# Altium project LF_SFF_AC.PrjPCB
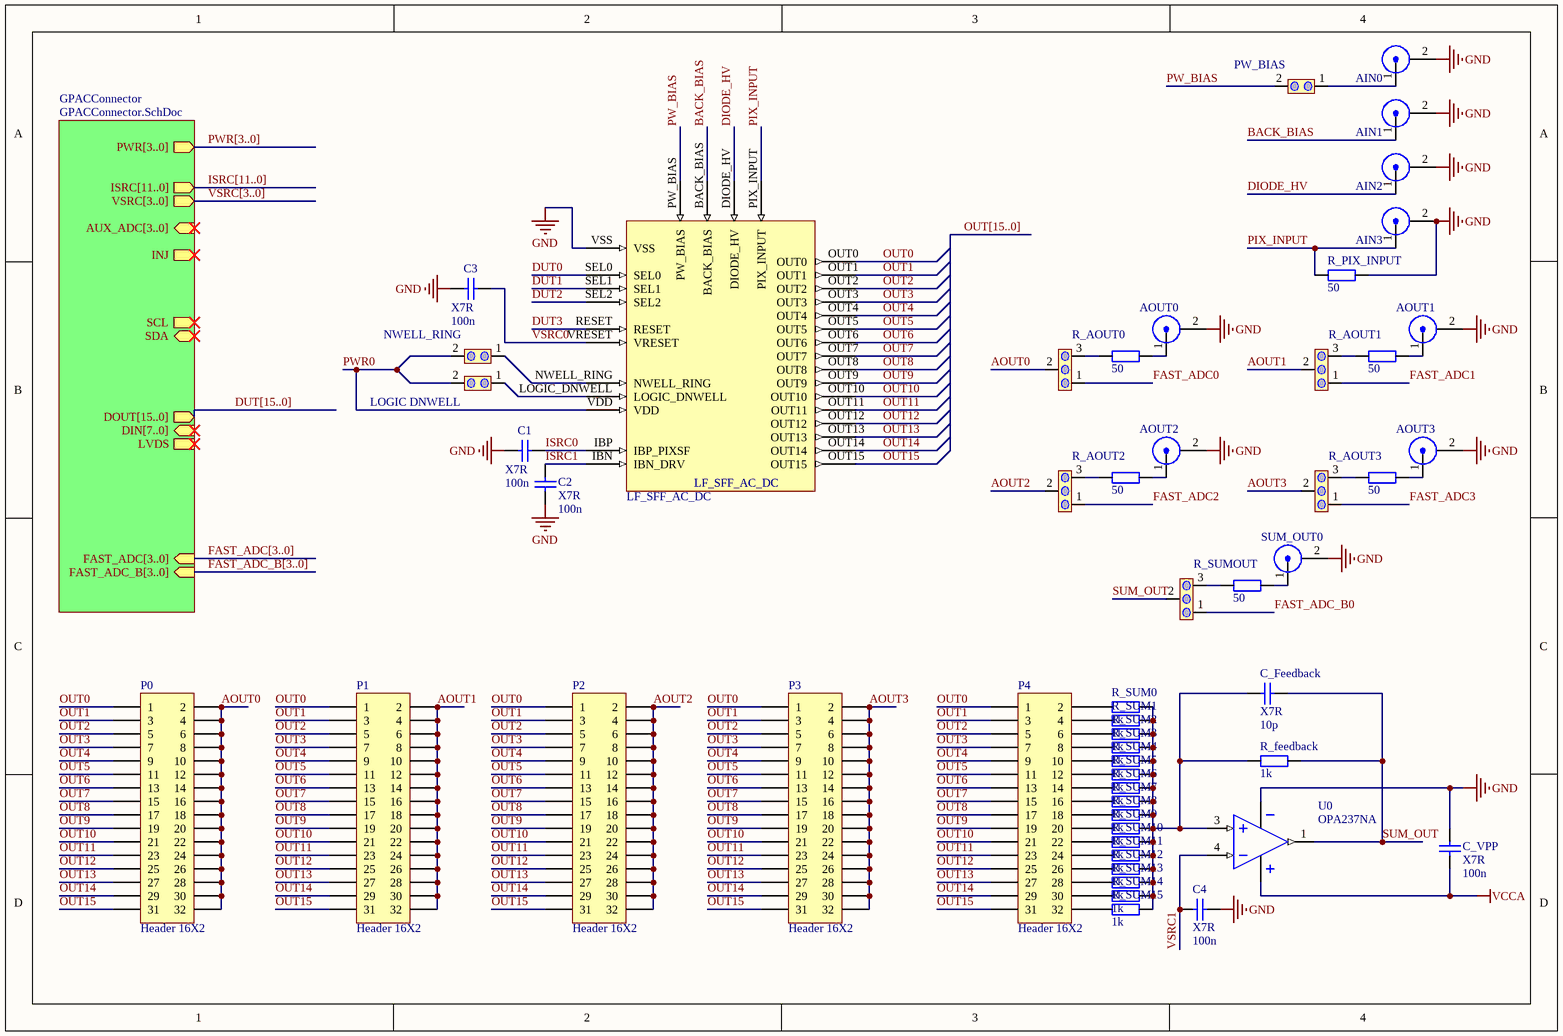
[diagram p0: LF_SDD_AC_DC.SchDoc]
2 sheets, 54 parts. Net scope: hierarchical (ports join the sheet entries above them; power ports are global).
Board file: LF_SFF_AC_DC.PcbDoc
Sheets:
  LF_SDD_AC_DC.SchDoc
    GPACConnector = GPACConnector.SchDoc

## Sheet LF_SDD_AC_DC.SchDoc
size A4; Author: Dominic Schüchter

### Parts
AIN0  -  [LEMO horiz.]  (value not drawn)
AIN1  -  [LEMO horiz.]  (value not drawn)
AIN2  -  [LEMO horiz.]  (value not drawn)
AIN3  -  [LEMO horiz.]  (value not drawn)
AOUT0  -  [LEMO horiz.]  (value not drawn)
AOUT1  -  [LEMO horiz.]  (value not drawn)
AOUT2  -  [LEMO horiz.]  (value not drawn)
AOUT3  -  [LEMO horiz.]  (value not drawn)
AOUT_SEL0  -  [HDR 1x3]  (value not drawn)
AOUT_SEL1  -  [HDR 1x3]  (value not drawn)
AOUT_SEL2  -  [HDR 1x3]  (value not drawn)
AOUT_SEL3  -  [HDR 1x3]  (value not drawn)
C1  X7R  value 100n  [C0603_imp_N]
C2  X7R  value 100n  [C0603_imp_N]
C3  X7R  value 100n  [C0603_imp_N]
C4  X7R  value 100n  [C0603_imp_N]
C_Feedback  X7R  value 10p  [C0603_imp_N]
C_VPP  X7R  value 100n  [C0603_imp_N]
LF_SFF_AC_DC  LF_SFF_AC_DC  [LF_SFF_COMBI]
LOGIC_DNWELL  -  [CON 1x2 std]  (value not drawn)
NWELL_RING  -  [CON 1x2 std]  (value not drawn)
P0  Header 16X2  [HDR2X16]
P1  Header 16X2  [HDR2X16]
P2  Header 16X2  [HDR2X16]
P3  Header 16X2  [HDR2X16]
P4  Header 16X2  [HDR2X16]
PW_BIAS  -  [CON 1x2 std]  (value not drawn)
R_AOUT0  value 50  [R0603_imp_N]  (hidden comment: R)
R_AOUT1  value 50  [R0603_imp_N]  (hidden comment: R)
R_AOUT2  value 50  [R0603_imp_N]  (hidden comment: R)
R_AOUT3  value 50  [R0603_imp_N]  (hidden comment: R)
R_feedback  value 1k  [R0805_imp_M]  (hidden comment: R)
R_PIX_INPUT  value 50  [R0603_imp_N]  (hidden comment: R)
R_SUM0  value 1k  [R0805_imp_M]  (hidden comment: R)
R_SUM1  value 1k  [R0805_imp_M]  (hidden comment: R)
R_SUM2  value 1k  [R0805_imp_M]  (hidden comment: R)
R_SUM3  value 1k  [R0805_imp_M]  (hidden comment: R)
R_SUM4  value 1k  [R0805_imp_M]  (hidden comment: R)
R_SUM5  value 1k  [R0805_imp_M]  (hidden comment: R)
R_SUM6  value 1k  [R0805_imp_M]  (hidden comment: R)
R_SUM7  value 1k  [R0805_imp_M]  (hidden comment: R)
R_SUM8  value 1k  [R0805_imp_M]  (hidden comment: R)
R_SUM9  value 1k  [R0805_imp_M]  (hidden comment: R)
R_SUM10  value 1k  [R0805_imp_M]  (hidden comment: R)
R_SUM11  value 1k  [R0805_imp_M]  (hidden comment: R)
R_SUM12  value 1k  [R0805_imp_M]  (hidden comment: R)
R_SUM13  value 1k  [R0805_imp_M]  (hidden comment: R)
R_SUM14  value 1k  [R0805_imp_M]  (hidden comment: R)
R_SUM15  value 1k  [R0805_imp_M]  (hidden comment: R)
R_SUMOUT  value 50  [R0603_imp_N]  (hidden comment: R)
SUM_OUT0  -  [LEMO horiz.]  (value not drawn)
SUM_SELECT  -  [HDR 1x3]  (value not drawn)
U0  Type_1: OPA237NA  [SOT23-5]  (hidden comment: OPA237)

### Sub-sheets
GPACConnector = GPACConnector.SchDoc: PWR[3..0] (out), ISRC[11..0] (out), VSRC[3..0] (out), AUX_ADC[3..0] (in), DOUT[15..0] (out), DIN[7..0] (in), FAST_ADC[3..0] (in), FAST_ADC_B[3..0] (in), LVDS (harness LVDS), INJ (out), SDA (bidir), SCL (out)

### Nets
GND: AIN0.2 AIN1.2 AIN2.2 AIN3.2 AOUT0.2 AOUT1.2 AOUT2.2 AOUT3.2 C1.2 C2.2 C3.2 C4.2 C_VPP.1 LF_SFF_AC_DC.VSS R_PIX_INPUT.2 SUM_OUT0.2 U0.2(V-)
VCCA: C_VPP.2 U0.5(V+)
AOUT0: AOUT_SEL0.2 P0.2 P0.4 P0.6 P0.8 P0.10 P0.12 P0.14 P0.16 P0.18 P0.20 P0.22 P0.24 P0.26 P0.28 P0.30 P0.32
AOUT1: AOUT_SEL1.2 P1.2 P1.4 P1.6 P1.8 P1.10 P1.12 P1.14 P1.16 P1.18 P1.20 P1.22 P1.24 P1.26 P1.28 P1.30 P1.32
AOUT2: AOUT_SEL2.2 P2.2 P2.4 P2.6 P2.8 P2.10 P2.12 P2.14 P2.16 P2.18 P2.20 P2.22 P2.24 P2.26 P2.28 P2.30 P2.32
AOUT3: AOUT_SEL3.2 P3.2 P3.4 P3.6 P3.8 P3.10 P3.12 P3.14 P3.16 P3.18 P3.20 P3.22 P3.24 P3.26 P3.28 P3.30 P3.32
BACK_BIAS: AIN1.1 LF_SFF_AC_DC.BACK_BIAS
DIODE_HV: AIN2.1 LF_SFF_AC_DC.DIODE_HV
DUT0: LF_SFF_AC_DC.SEL0  [project net DOUT0]
DUT1: LF_SFF_AC_DC.SEL1  [project net DOUT1]
DUT2: LF_SFF_AC_DC.SEL2  [project net DOUT2]
DUT3: LF_SFF_AC_DC.RESET  [project net DOUT3]
FAST_ADC0: AOUT_SEL0.1
FAST_ADC1: AOUT_SEL1.1
FAST_ADC2: AOUT_SEL2.1
FAST_ADC3: AOUT_SEL3.1
FAST_ADC_B0: SUM_SELECT.1
ISRC0: C1.1 LF_SFF_AC_DC.IBP(IBP_PIXSF)
ISRC1: C2.1 LF_SFF_AC_DC.IBN(IBN_DRV)
OUT0: LF_SFF_AC_DC.OUT0 P0.1 P1.1 P2.1 P3.1 P4.1
OUT1: LF_SFF_AC_DC.OUT1 P0.3 P1.3 P2.3 P3.3 P4.3
OUT2: LF_SFF_AC_DC.OUT2 P0.5 P1.5 P2.5 P3.5 P4.5
OUT3: LF_SFF_AC_DC.OUT3 P0.7 P1.7 P2.7 P3.7 P4.7
OUT4: LF_SFF_AC_DC.OUT4 P0.9 P1.9 P2.9 P3.9 P4.9
OUT5: LF_SFF_AC_DC.OUT5 P0.11 P1.11 P2.11 P3.11 P4.11
OUT6: LF_SFF_AC_DC.OUT6 P0.13 P1.13 P2.13 P3.13 P4.13
OUT7: LF_SFF_AC_DC.OUT7 P0.15 P1.15 P2.15 P3.15 P4.15
OUT8: LF_SFF_AC_DC.OUT8 P0.17 P1.17 P2.17 P3.17 P4.17
OUT9: LF_SFF_AC_DC.OUT9 P0.19 P1.19 P2.19 P3.19 P4.19
OUT10: LF_SFF_AC_DC.OUT10 P0.21 P1.21 P2.21 P3.21 P4.21
OUT11: LF_SFF_AC_DC.OUT11 P0.23 P1.23 P2.23 P3.23 P4.23
OUT12: LF_SFF_AC_DC.OUT12 P0.25 P1.25 P2.25 P3.25 P4.25
OUT13: LF_SFF_AC_DC.OUT13 P0.27 P1.27 P2.27 P3.27 P4.27
OUT14: LF_SFF_AC_DC.OUT14 P0.29 P1.29 P2.29 P3.29 P4.29
OUT15: LF_SFF_AC_DC.OUT15 P0.31 P1.31 P2.31 P3.31 P4.31
PIX_INPUT: AIN3.1 LF_SFF_AC_DC.PIX_INPUT R_PIX_INPUT.1
PW_BIAS: LF_SFF_AC_DC.PW_BIAS PW_BIAS.2
PWR0: LF_SFF_AC_DC.VDD LOGIC_DNWELL.2 NWELL_RING.2
SUM_OUT: C_Feedback.2 R_feedback.2 SUM_SELECT.2 U0.1(OUT)
VSRC0: C3.1 LF_SFF_AC_DC.VRESET
VSRC1: C4.1 U0.4(IN-)
NetAIN0_1: AIN0.1 PW_BIAS.1
NetAOUT0_1: AOUT0.1 R_AOUT0.1
NetAOUT1_1: AOUT1.1 R_AOUT1.1
NetAOUT2_1: AOUT2.1 R_AOUT2.1
NetAOUT3_1: AOUT3.1 R_AOUT3.1
NetAOUT_SEL0_3: AOUT_SEL0.3 R_AOUT0.2
NetAOUT_SEL1_3: AOUT_SEL1.3 R_AOUT1.2
NetAOUT_SEL2_3: AOUT_SEL2.3 R_AOUT2.2
NetAOUT_SEL3_3: AOUT_SEL3.3 R_AOUT3.2
NetC_Feedback_1: C_Feedback.1 R_feedback.1 R_SUM0.2 R_SUM1.2 R_SUM2.2 R_SUM3.2 R_SUM4.2 R_SUM5.2 R_SUM6.2 R_SUM7.2 R_SUM8.2 R_SUM9.2 R_SUM10.2 R_SUM11.2 R_SUM12.2 R_SUM13.2 R_SUM14.2 R_SUM15.2 U0.3(IN+)
NetLF_SFF_AC_DC_LOGIC_DNWELL: LF_SFF_AC_DC.LOGIC_DNWELL LOGIC_DNWELL.1
NetLF_SFF_AC_DC_NWELL_RING: LF_SFF_AC_DC.NWELL_RING NWELL_RING.1
NetP4_2: P4.2 R_SUM0.1
NetP4_4: P4.4 R_SUM1.1
NetP4_6: P4.6 R_SUM2.1
NetP4_8: P4.8 R_SUM3.1
NetP4_10: P4.10 R_SUM4.1
NetP4_12: P4.12 R_SUM5.1
NetP4_14: P4.14 R_SUM6.1
NetP4_16: P4.16 R_SUM7.1
NetP4_18: P4.18 R_SUM8.1
NetP4_20: P4.20 R_SUM9.1
NetP4_22: P4.22 R_SUM10.1
NetP4_24: P4.24 R_SUM11.1
NetP4_26: P4.26 R_SUM12.1
NetP4_28: P4.28 R_SUM13.1
NetP4_30: P4.30 R_SUM14.1
NetP4_32: P4.32 R_SUM15.1
NetR_SUMOUT_1: R_SUMOUT.1 SUM_OUT0.1
NetR_SUMOUT_2: R_SUMOUT.2 SUM_SELECT.3

### Buses and harness runs
bus DUT[15..0] = sheet GPACConnector/DOUT[15..0]
bus FAST_ADC[3..0] = sheet GPACConnector/FAST_ADC[3..0]
bus FAST_ADC_B[3..0] = sheet GPACConnector/FAST_ADC_B[3..0]
bus ISRC[11..0] = sheet GPACConnector/ISRC[11..0]
bus OUT[15..0]
bus PWR[3..0] = sheet GPACConnector/PWR[3..0]
bus VSRC[3..0] = sheet GPACConnector/VSRC[3..0]

### Library data of the parts
AIN0-AIN3 AOUT0-AOUT3 SUM_OUT0 = LEMO coax: LEMO/BNC Buchse, aufrecht od. gewinkelt; Class: Connector; Comment_1: LEMO; Type_1: EPL.00.250.NTN; Constraints: -; HelpURL: -; LatestRevisionDate: 24-Sep-2008; Publisher: Silab C.H.; Value: -; PackageDescription: -
AOUT_SEL0-AOUT_SEL3 SUM_SELECT = JUMPER 1X3S: Jumper, Solderbridge 1x3; Class: Connector; Comment_1: -; Constraints: -; HelpURL: -; LatestRevisionDate: 24-Sep-2008; Publisher: Silab C.H.; Type_1: -; Value: -; PackageDescription: -
C1-C4 C_Feedback C_VPP = C: Capacitor; Constraints: 6.3V; Class: Passive; Type_1: SMD Chip Capacitor; Comment_1: -; LatestRevisionDate: 27-Nov-2007; Publisher: Silab J.S.; HelpURL: -; PackageDescription: -
LF_SFF_AC_DC = LF_SFF_AC
LOGIC_DNWELL NWELL_RING PW_BIAS = JUMPER 1X2S: Jumper, Solderbridge 1x2; Class: Connector; Comment_1: -; Constraints: -; HelpURL: -; LatestRevisionDate: 24-Sep-2008; Publisher: Silab C.H.; Type_1: -; Value: -; PackageDescription: -
P0-P4 = Header 16X2: Header, 16-Pin, Dual row; LatestRevisionDate: 17-Jul-2002; LatestRevisionNote: Re-released for DXP Platform.; Publisher: Altium Limited
R_AOUT0-R_AOUT3 R_feedback R_PIX_INPUT R_SUM0-R_SUM15 R_SUMOUT = R: SMD Chip Resistor; Constraints: 1%; Class: Passive; Comment_1: -; Publisher: Silab J.S.; LatestRevisionDate: 27-Nov-2007; HelpURL: -; Type_1: SMD Chip Resistor; PackageDescription: -
U0 = OPA237: OpAmp (TI), single supply up to +36V;; Class: Active; Comment_1: Texas Instruments; Netto_price: 1,58; Order_number: 1207102; Constraints: -; HelpURL: http://focus.ti.com/lit/ds/symlink/opa237.pdf; LatestRevisionDate: 26-Aug-2009; Publisher: Silab J.S.; Value: -; PackageDescription: -; Distributor: Farnell

## Sheet GPACConnector.SchDoc: GPAC Connector
size A4; Author: H.Krüger; DrawnBy: H.Krüger; Organization: SILAB; Address1: Physikalisches Institut; Address2: Universität Bonn; Address3: Nußallee 12; Address4: 53115 Bonn; Revision: 1.1; SheetNumber: 2; SheetTotal: 2; Project: XTB01 Carrier
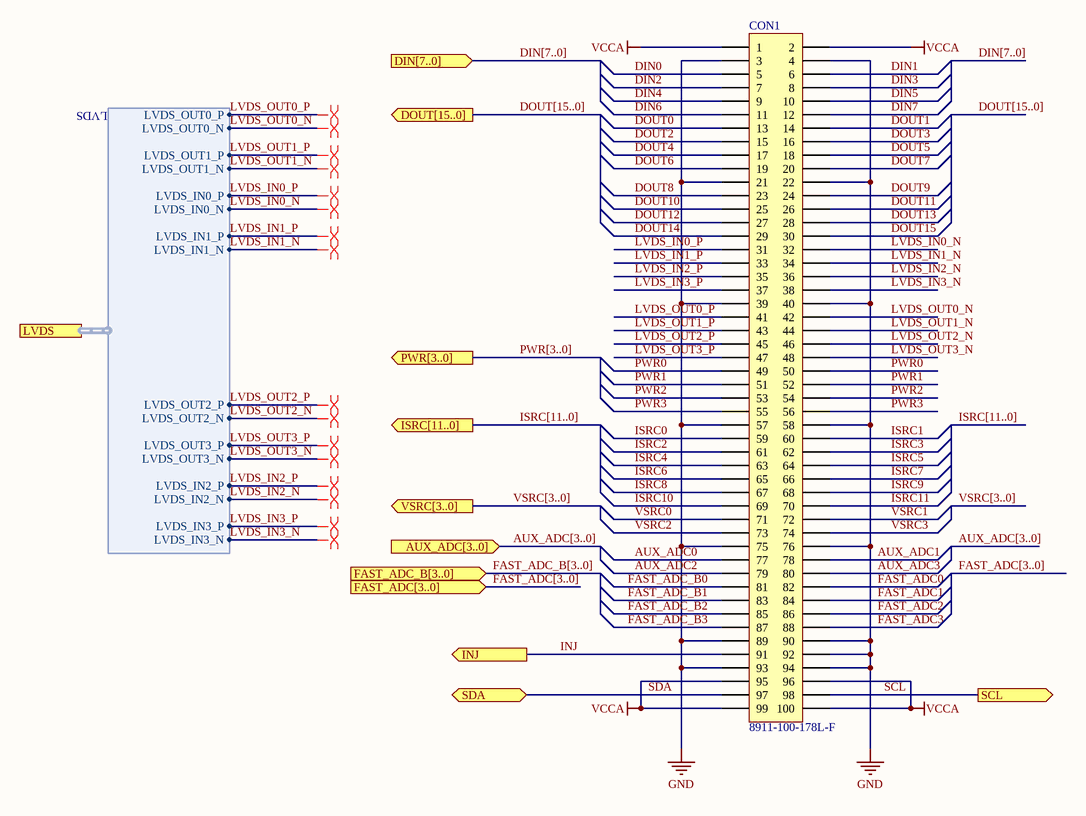
[diagram p1: GPACConnector.SchDoc]

### Parts
CON1  Type_1: 8911-100-178L-F  [KEL 8911-100-178L-F, PLUG]  (hidden comment: -)

### Ports
AUX_ADC[3..0] (in), DIN[7..0] (in), DOUT[15..0] (out), FAST_ADC[3..0] (in), FAST_ADC_B[3..0] (in), INJ (out), ISRC[11..0] (out), LVDS (harness LVDS), PWR[3..0] (out), SCL (out), SDA (bidir), VSRC[3..0] (out)

### Harnesses
LVDS: LVDS_IN0_P, LVDS_IN0_N, LVDS_IN1_P, LVDS_IN1_N, LVDS_OUT0_P, LVDS_OUT0_N, LVDS_OUT1_P, LVDS_OUT1_N, LVDS_IN2_P, LVDS_IN2_N, LVDS_IN3_P, LVDS_IN3_N, LVDS_OUT2_P, LVDS_OUT2_N, LVDS_OUT3_P, LVDS_OUT3_N

### Nets
GND: CON1.3 CON1.4 CON1.21 CON1.22 CON1.39 CON1.40 CON1.57 CON1.58 CON1.75 CON1.76 CON1.89 CON1.90 CON1.92 CON1.93 CON1.94
VCCA: CON1.1 CON1.2 CON1.95 CON1.96 CON1.99 CON1.100
AUX_ADC0: CON1.77
AUX_ADC1: CON1.78
AUX_ADC2: CON1.79
AUX_ADC3: CON1.80
DIN0: CON1.5
DIN1: CON1.6
DIN2: CON1.7
DIN3: CON1.8
DIN4: CON1.9
DIN5: CON1.10
DIN6: CON1.11
DIN7: CON1.12
DOUT0: CON1.13
DOUT1: CON1.14
DOUT2: CON1.15
DOUT3: CON1.16
DOUT4: CON1.17
DOUT5: CON1.18
DOUT6: CON1.19
DOUT7: CON1.20
DOUT8: CON1.23
DOUT9: CON1.24
DOUT10: CON1.25
DOUT11: CON1.26
DOUT12: CON1.27
DOUT13: CON1.28
DOUT14: CON1.29
DOUT15: CON1.30
FAST_ADC0: CON1.82
FAST_ADC1: CON1.84
FAST_ADC2: CON1.86
FAST_ADC3: CON1.88
FAST_ADC_B0: CON1.81
FAST_ADC_B1: CON1.83
FAST_ADC_B2: CON1.85
FAST_ADC_B3: CON1.87
INJ: CON1.91 ; port INJ
ISRC0: CON1.59
ISRC1: CON1.60
ISRC2: CON1.61
ISRC3: CON1.62
ISRC4: CON1.63
ISRC5: CON1.64
ISRC6: CON1.65
ISRC7: CON1.66
ISRC8: CON1.67
ISRC9: CON1.68
ISRC10: CON1.69
ISRC11: CON1.70
LVDS_IN0_N: CON1.32 ; port LVDS.LVDS_IN0_N
LVDS_IN0_P: CON1.31 ; port LVDS.LVDS_IN0_P
LVDS_IN1_N: CON1.34 ; port LVDS.LVDS_IN1_N
LVDS_IN1_P: CON1.33 ; port LVDS.LVDS_IN1_P
LVDS_IN2_N: CON1.36 ; port LVDS.LVDS_IN2_N
LVDS_IN2_P: CON1.35 ; port LVDS.LVDS_IN2_P
LVDS_IN3_N: CON1.38 ; port LVDS.LVDS_IN3_N
LVDS_IN3_P: CON1.37 ; port LVDS.LVDS_IN3_P
LVDS_OUT0_N: CON1.42 ; port LVDS.LVDS_OUT0_N
LVDS_OUT0_P: CON1.41 ; port LVDS.LVDS_OUT0_P
LVDS_OUT1_N: CON1.44 ; port LVDS.LVDS_OUT1_N
LVDS_OUT1_P: CON1.43 ; port LVDS.LVDS_OUT1_P
LVDS_OUT2_N: CON1.46 ; port LVDS.LVDS_OUT2_N
LVDS_OUT2_P: CON1.45 ; port LVDS.LVDS_OUT2_P
LVDS_OUT3_N: CON1.48 ; port LVDS.LVDS_OUT3_N
LVDS_OUT3_P: CON1.47 ; port LVDS.LVDS_OUT3_P
PWR0: CON1.49 CON1.50
PWR1: CON1.51 CON1.52
PWR2: CON1.53 CON1.54
PWR3: CON1.55 CON1.56
SCL: CON1.98 ; port SCL
SDA: CON1.97 ; port SDA
VSRC0: CON1.71
VSRC1: CON1.72
VSRC2: CON1.73
VSRC3: CON1.74

### Buses and harness runs
bus AUX_ADC[3..0]
bus AUX_ADC[3..0] = port AUX_ADC[3..0]
bus DIN[7..0]
bus DIN[7..0] = port DIN[7..0]
bus DOUT[15..0]
bus DOUT[15..0] = port DOUT[15..0]
bus FAST_ADC[3..0]
bus FAST_ADC[3..0] = port FAST_ADC[3..0]
bus FAST_ADC_B[3..0] = port FAST_ADC_B[3..0]
bus ISRC[11..0]
bus ISRC[11..0] = port ISRC[11..0]
bus PWR[3..0] = port PWR[3..0]
bus VSRC[3..0]
bus VSRC[3..0] = port VSRC[3..0]

### Layout directives
differential pair: LVDS_IN0_N, LVDS_IN0_P, LVDS_IN1_N, LVDS_IN1_P, LVDS_IN2_N, LVDS_IN2_P, LVDS_IN3_N, LVDS_IN3_P, LVDS_OUT0_N, LVDS_OUT0_P, LVDS_OUT1_N, LVDS_OUT1_P, LVDS_OUT2_N, LVDS_OUT2_P, LVDS_OUT3_N, LVDS_OUT3_P

### Notes on the sheet
- Title:
- Drawn by:
- Physikalisches Institut
- Universität Bonn
- Project:
- Date:
- File:
- Time:
- Revision:
- Sheet
- of
- Nußallee 12
- 53115 Bonn

### Library data of the parts
CON1 = CON KEL 8911, male: KEL 8911 100 pin board to board connector; Revision: July-2002: Re-released for DXP Platform.; Publisher: Silab J.S.; Class: Connector; Value: -; Constraints: -; HelpURL: http://www.kel.jp/english/product/Half_8900/8900.pdf; LatestRevisionDate:: 24-Sep-2008; Comment_1: KEL; PackageDescription: -

## Nets that join several sheets
GND: LF_SDD_AC_DC (17 pins), GPACConnector (15 pins)
VCCA: LF_SDD_AC_DC (C_VPP.2 U0.5), GPACConnector (6 pins)
DOUT0: LF_SDD_AC_DC (LF_SFF_AC_DC.SEL0), GPACConnector (CON1.13)
DOUT1: LF_SDD_AC_DC (LF_SFF_AC_DC.SEL1), GPACConnector (CON1.14)
DOUT2: LF_SDD_AC_DC (LF_SFF_AC_DC.SEL2), GPACConnector (CON1.15)
DOUT3: LF_SDD_AC_DC (LF_SFF_AC_DC.RESET), GPACConnector (CON1.16)
FAST_ADC0: LF_SDD_AC_DC (AOUT_SEL0.1), GPACConnector (CON1.82)
FAST_ADC1: LF_SDD_AC_DC (AOUT_SEL1.1), GPACConnector (CON1.84)
FAST_ADC2: LF_SDD_AC_DC (AOUT_SEL2.1), GPACConnector (CON1.86)
FAST_ADC3: LF_SDD_AC_DC (AOUT_SEL3.1), GPACConnector (CON1.88)
FAST_ADC_B0: LF_SDD_AC_DC (SUM_SELECT.1), GPACConnector (CON1.81)
ISRC0: LF_SDD_AC_DC (C1.1 LF_SFF_AC_DC.IBP), GPACConnector (CON1.59)
ISRC1: LF_SDD_AC_DC (C2.1 LF_SFF_AC_DC.IBN), GPACConnector (CON1.60)
PWR0: LF_SDD_AC_DC (LF_SFF_AC_DC.VDD LOGIC_DNWELL.2 NWELL_RING.2), GPACConnector (CON1.49 CON1.50)
VSRC0: LF_SDD_AC_DC (C3.1 LF_SFF_AC_DC.VRESET), GPACConnector (CON1.71)
VSRC1: LF_SDD_AC_DC (C4.1 U0.4), GPACConnector (CON1.72)